# Altium schematic sheet 02_PCIE.SchDoc: =GlobalProjectName
size 594 x 420 mm; CheckedBy: A_D; Author: A_D; SheetNumber: 2; SheetTotal: 4; PageSetup: Record=PageOptions|CenterHorizontal=True|CenterVertical=True|PrintScale=0.70|XCorrection=1.00|YCorrection=1.00|PrintKind=2|BorderSize=5000000|LeftOffset=9000|BottomOffset=10100|Orientation=2|PaperLength=11176|PaperWidth=8636|Scale=100|PaperSource=259|PrintQuality=-3|MediaType=1|DitherType=10|PrintScaleMode=1|PaperKind=A3|PaperIndex=8
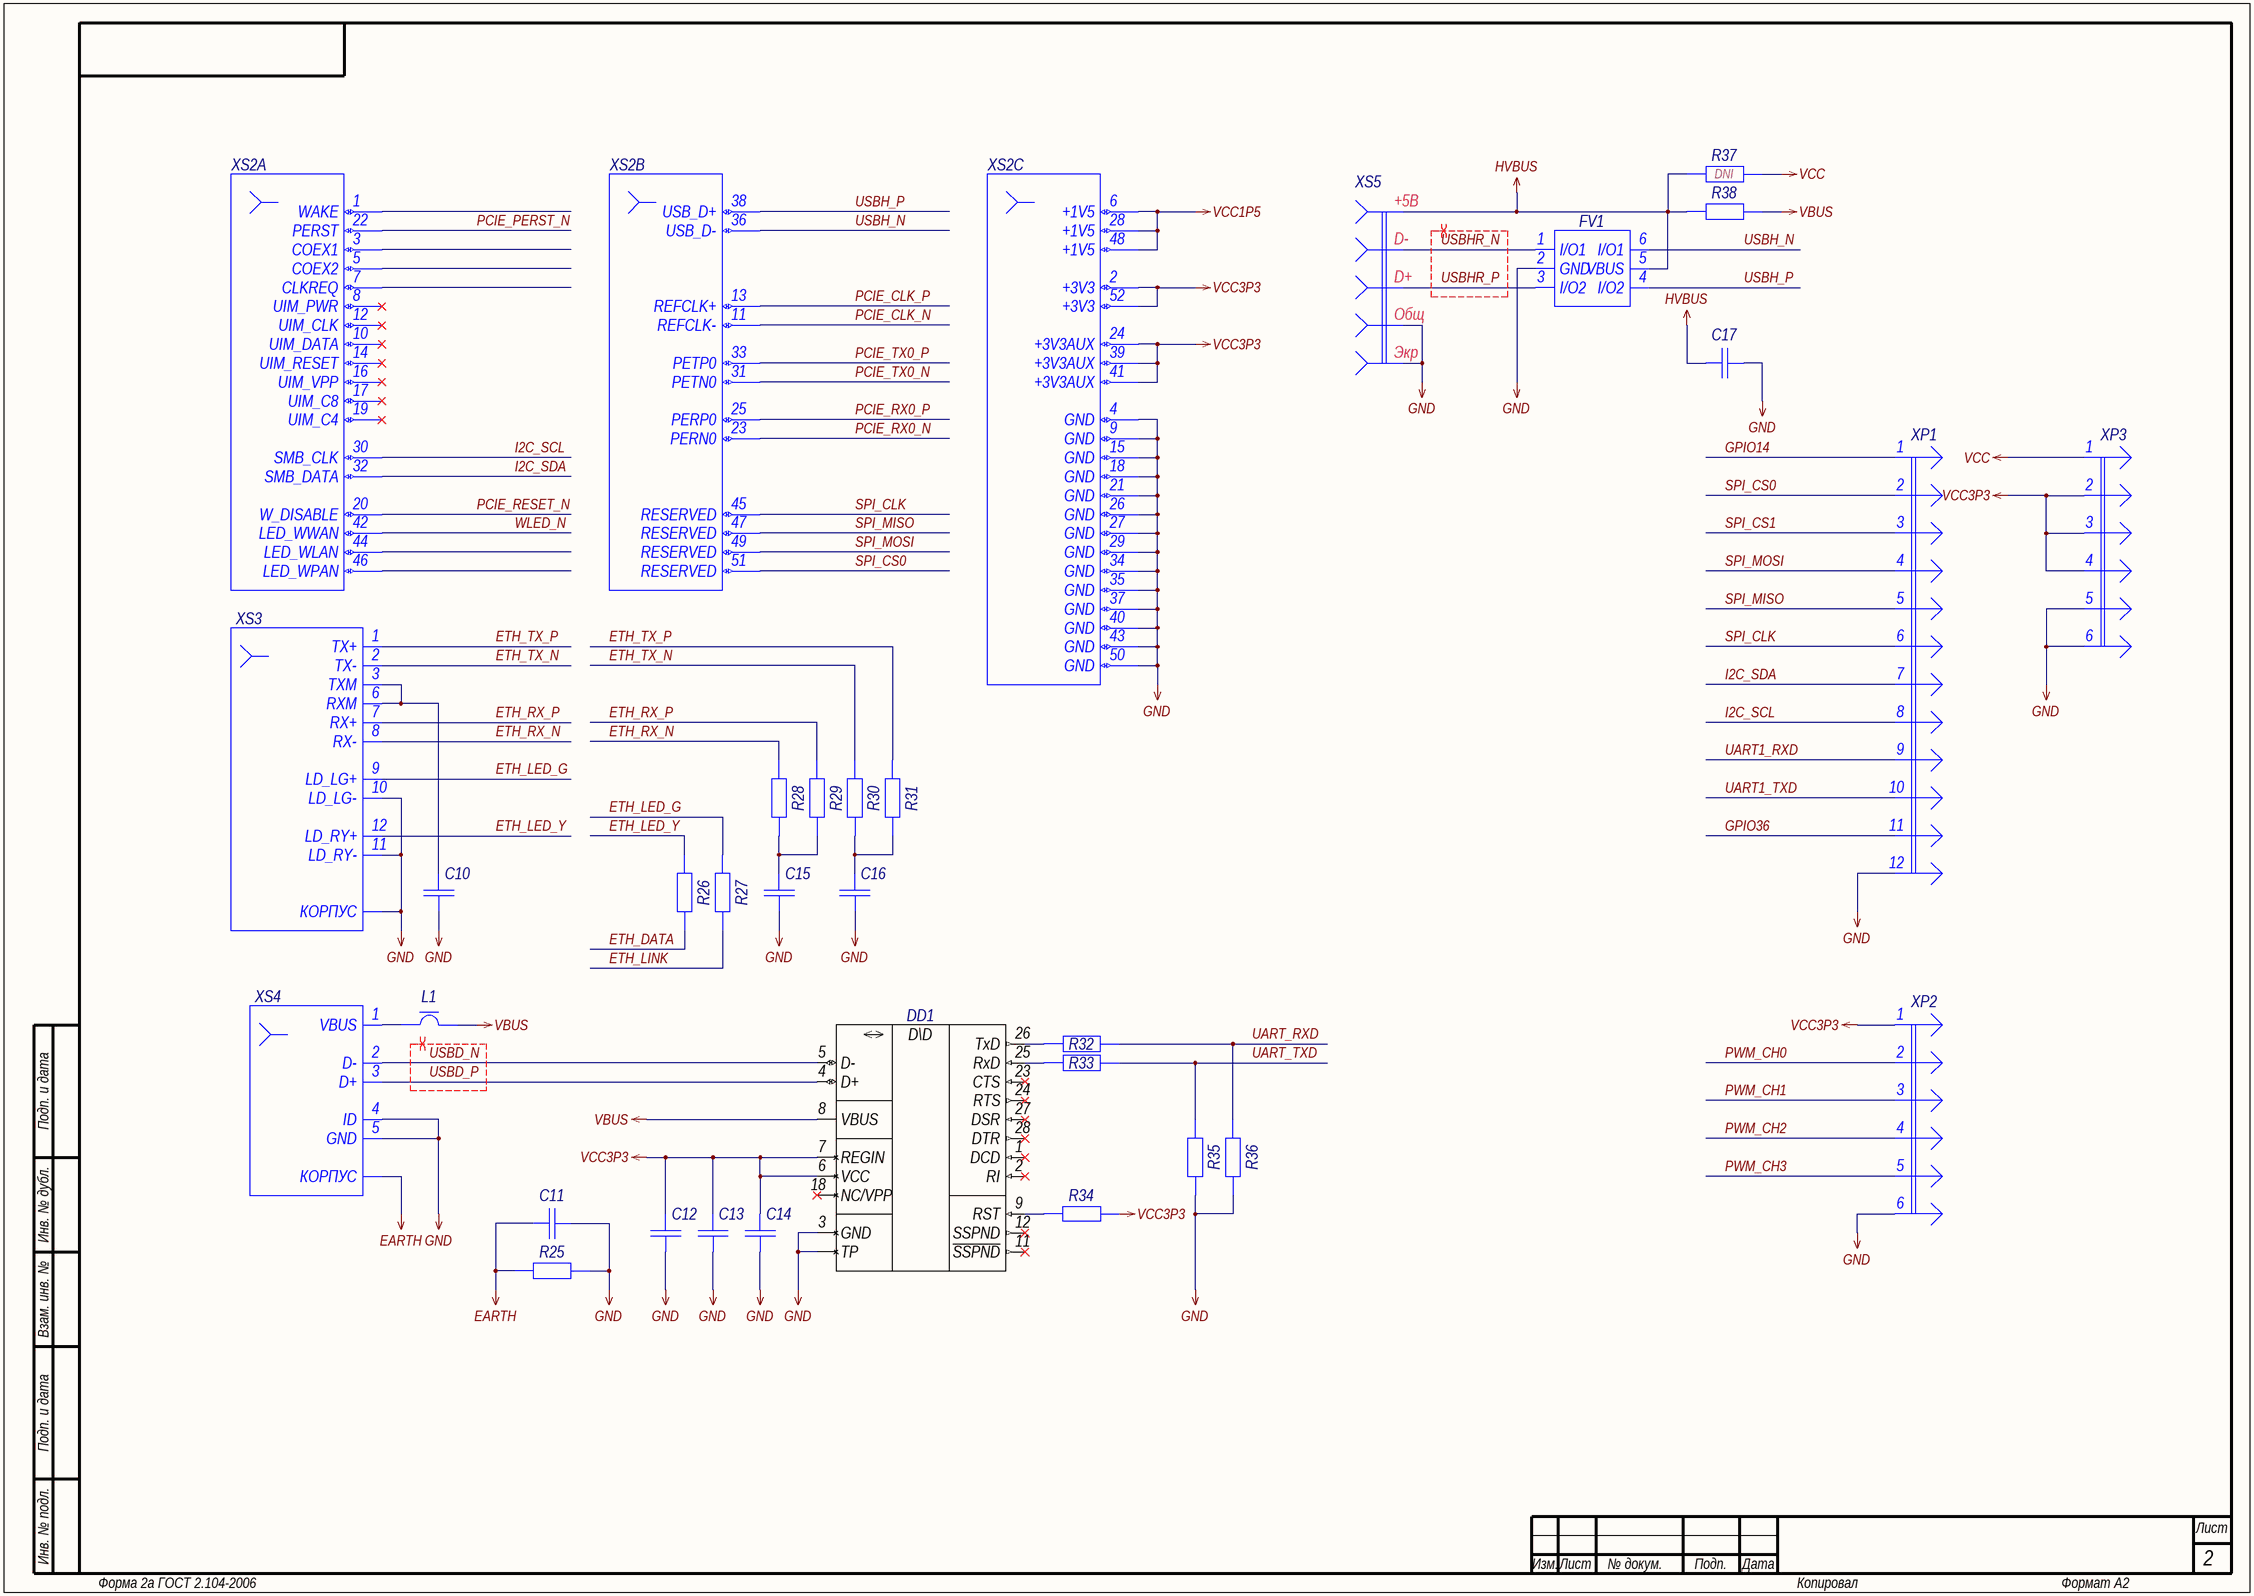
[diagram p0: 02_PCIE.SchDoc]

## Parts
C10  Capacitor  [C0603_L]  (value not drawn)
C11  Capacitor  [C0603_L]  (value not drawn)
C12  Capacitor  [C0603_L]  (value not drawn)
C13  Capacitor  [C0603_L]  (value not drawn)
C14  Capacitor  [C0603_L]  (value not drawn)
C15  Capacitor  [C0603_L]  (value not drawn)
C16  Capacitor  [C0603_L]  (value not drawn)
C17  Capacitor  [C0603_L]  (value not drawn)
DD1  CP2102_9  [QFN-28_050P500X500X100_N]  (value not drawn)
FV1  USBLC6-2SC6  [SOT-23-6_095P290X160X145_N]  (value not drawn)
L1  FerriteBead  [L0805_L]  (value not drawn)
R25  Resistor  [R0603_L]  (value not drawn)
R26  Resistor  [R0603_L]  (value not drawn)
R27  Resistor  [R0603_L]  (value not drawn)
R28  Resistor  [R0603_L]  (value not drawn)
R29  Resistor  [R0603_L]  (value not drawn)
R30  Resistor  [R0603_L]  (value not drawn)
R31  Resistor  [R0603_L]  (value not drawn)
R32  Resistor  [R0603_L]  (value not drawn)
R33  Resistor  [R0603_L]  (value not drawn)
R34  Resistor  [R0603_L]  (value not drawn)
R35  Resistor  [R0603_L]  (value not drawn)
R36  Resistor  [R0603_L]  (value not drawn)
R37  Resistor  [R0603_L]  (value not drawn)  (no BOM)
R38  Resistor  [R0603_L]  (value not drawn)
XP1  IO  [PLS-12]  (value not drawn)
XP2  POWER  [PLS-6]  (value not drawn)
XP3  POWER  [PLS-6]  (value not drawn)
XS2  Text  [2041119-2]  (value not drawn)  (parts A,B,C of 3)  (no BOM)
XS3  ETH  [SK02-111006NL]  (value not drawn)
XS4  Text  [A01SB141B1-067]  (value not drawn)
XS5  Text  [DS1095]  (value not drawn)

## Nets
EARTH: C11.2 R25.1 XS4.SHELL(КОРПУС)
GND: C10.1 C11.1 C12.1 C13.1 C14.1 C15.1 C16.1 C17.2 DD1.3(GND) DD1.TP FV1.2(GND) R25.2 R35.1 R36.1 XP1.12 XP2.6 XP3.5 XP3.6 XS2.4(GND) XS2.9(GND) XS2.15(GND) XS2.18(GND) XS2.21(GND) XS2.26(GND) XS2.27(GND) XS2.29(GND) XS2.34(GND) XS2.35(GND) XS2.37(GND) XS2.40(GND) XS2.43(GND) XS2.50(GND) XS3.10(LD_LG-) XS3.11(LD_RY-) XS3.CASE(КОРПУС) XS4.4(ID) XS4.5(GND) XS5.4 XS5.5
HVBUS: C17.1 FV1.5(VBUS) R37.1 R38.1 XS5.1
VBUS: DD1.8(VBUS) L1.2 R38.2
VCC: R37.2 XP3.1
VCC1P5: XS2.6(+1V5) XS2.28(+1V5) XS2.48(+1V5)
VCC3P3: C12.2 C13.2 C14.2 DD1.6(VCC) DD1.7(REGIN) R34.1 XP2.1 XP3.2 XP3.3 XP3.4 XS2.2(+3V3) XS2.24(+3V3AUX) XS2.39(+3V3AUX) XS2.41(+3V3AUX) XS2.52(+3V3)
ETH_DATA: R26.1
ETH_LED_G: R27.2 XS3.9(LD_LG+)
ETH_LED_Y: R26.2 XS3.12(LD_RY+)
ETH_LINK: R27.1
ETH_RX_N: R28.2 XS3.8(RX-)
ETH_RX_P: R29.2 XS3.7(RX+)
ETH_TX_N: R30.2 XS3.2(TX-)
ETH_TX_P: R31.2 XS3.1(TX+)
GPIO14: XP1.1
GPIO36: XP1.11
I2C_SCL: XP1.8 XS2.30(SMB_CLK)
I2C_SDA: XP1.7 XS2.32(SMB_DATA)
PCIE_CLK_N: XS2.11(REFCLK-)
PCIE_CLK_P: XS2.13(REFCLK+)
PCIE_PERST_N: XS2.22(PERST)
PCIE_RESET_N: XS2.20(W_DISABLE)
PCIE_RX0_N: XS2.23(PERN0)
PCIE_RX0_P: XS2.25(PERP0)
PCIE_TX0_N: XS2.31(PETN0)
PCIE_TX0_P: XS2.33(PETP0)
PWM_CH0: XP2.2
PWM_CH1: XP2.3
PWM_CH2: XP2.4
PWM_CH3: XP2.5
SPI_CLK: XP1.6 XS2.45(RESERVED)
SPI_CS0: XP1.2 XS2.51(RESERVED)
SPI_CS1: XP1.3
SPI_MISO: XP1.5 XS2.47(RESERVED)
SPI_MOSI: XP1.4 XS2.49(RESERVED)
UART1_RXD: XP1.9
UART1_TXD: XP1.10
UART_RXD: R32.2 R36.2
UART_TXD: R33.2 R35.2
USBD_N: DD1.5(D-) XS4.2(D-)
USBD_P: DD1.4(D+) XS4.3(D+)
USBH_N: FV1.6(I/O1) XS2.36(USB_D-)
USBH_P: FV1.4(I/O2) XS2.38(USB_D+)
USBHR_N: FV1.1(I/O1) XS5.2
USBHR_P: FV1.3(I/O2) XS5.3
WLED_N: XS2.42(LED_WWAN)
NetC10_2: C10.2 XS3.3(TXM) XS3.6(RXM)
NetC15_2: C15.2 R28.1 R29.1
NetC16_2: C16.2 R30.1 R31.1
NetDD1_9: DD1.9(RST) R34.2
NetDD1_25: DD1.25(RxD) R33.1
NetDD1_26: DD1.26(TxD) R32.1
NetL1_1: L1.1 XS4.1(VBUS)

Not connected (* = marked no-connect by the designer): DD1 1(DCD)* 2(RI)* 11(~{SSPND})* 12(SSPND)* 18(NC/VPP)* 23(CTS)* 24(RTS)* 27(DSR)* 28(DTR)*; XS2 1(WAKE) 3(COEX1) 5(COEX2) 7(CLKREQ) 8(UIM_PWR)* 10(UIM_DATA)* 12(UIM_CLK)* 14(UIM_RESET)* 16(UIM_VPP)* 17(UIM_C8)* 19(UIM_C4)* 44(LED_WLAN) 46(LED_WPAN)

## Layout directives
differential pair; differential pair class USB_DiffPair; rule Matched Net Lengths [Tolerance = 1mm]: USBD_N, USBD_P, USBHR_N, USBHR_P

## Notes on the sheet
- (near R37) DNI
- Подп. и дата
- Инв. № дубл.
- Взам. инв. №
- Инв. № подл.
- Изм.
- Лист
- № докум.
- Подп.
- Дата
- Форма 2а ГОСТ 2.104-2006
- Копировал
- Формат А2
- (in symbol CP2102-GM) D\D
- (in symbol DS1095-B-R) +5В; D-; D+; Общ; Экр

## Library data of the parts
C10 C11 C13-C16 = GRM188R72A104KA35D: Manufacturer: Murata; Type: Конденсатор; ID: 232; Value: 0.1uF; Voltage: 100V; Tolerance: ±10%; Dielectric Type: X7R; Application Category: 1; Working Temperature Min: -55°С; Working Temperature Max: +125°С; Published: 18.05.2010; Publisher: Andrew Danich; Part Number: GRM188R72A104KA35D; Footprint: 0603
  C11: ClassName: DirectConnect
C12 = GCM188R71E105KA64D: Manufacturer: Murata; Type: Конденсатор; ID: 134; Value: 1uF; Voltage: 25V; Tolerance: ±10%; Dielectric Type: X7R; Application Category: 1; Working Temperature Min: -55°С; Working Temperature Max: +85°С; Published: 18.05.2010; Publisher: Andrew Danich; Part Number: GCM188R71E105KA64D; Footprint: 0603
C17 = GRM188R61A106KE69D: Manufacturer: Murata; Type: Конденсатор; ID: 173; Value: 10uF; Voltage: 10V; Tolerance: ±10%; Dielectric Type: X5R; Application Category: 1; Working Temperature Min: -55°С; Working Temperature Max: +85°С; Published: 18.05.2010; Publisher: Andrew Danich; Part Number: GRM188R61A106KE69D; Footprint: 0603
DD1 = CP2102-GM: Single Chip USB to UART Bridge; Manufacturer: Silicon Labs; ID: 4; Supply Operation: +3.3V; Supply Current: 13.7mA; USB Type Support: USB 2.0; USB Speed Support: 12 Mb/s; OTG Support: No; Channels: 1; Working Temperature Min: -40°C; Working Temperature Max: +85°C; Published: 03.08.2015; Publisher: Andrew Danich; Type: Микросхема; Part Number: CP2102-GM; Value: CP2102-GM; Input Interface: UART; Application Category: 1; Functional Analog: -
FV1 = USBLC6-2SC6: Manufacturer: STMicroelectronics; ID: 11; Breakdown Voltage: 6V; Reverse Stand Off Voltage: 17V; Forward Voltage: 0.95V; Peak Forward Current: 5A; Junction Capacitance: 2.5pF; Directional: Bidirectional; Application Category: 1; Working Temperature Min: -40°С; Working Temperature Max: +125°С; Published: 21.02.2017; Publisher: Andrew Danich; Type: Супрессор; Part Number: USBLC6-2SC6; Value: USBLC6-2SC6; Functional Analog: -
L1 = BLM21PG331SN1: Manufacturer: Murata; Type: Дроссель; ID: 2; Rated Current: 1.5A; Impedance at 100Mhz: 330ohm; Tolerance: ±25%; DC Resistance: 0.07ohm; Inductor Type: EMIFIL; Application Category: 1; Working Temperature Min: -55°С; Working Temperature Max: +125°С; Published: 14.11.2014; Publisher: Andrew Danich; Part Number: BLM21PG331SN1; Value: BLM21PG331SN1; Footprint: 0805; ClassName: DirectConnect
R25 = RC0603JR-07100KL: Manufacturer: Yageo; ID: 11; Value: 100k; Limit Voltage: 50V; Tolerance: ±5%; Temperature Coefficient: 100ppm; Total Power Dissipation: 0.1W; Series Type: Thick-Film; Application Category: 1; Working Temperature Min: -55°С; Working Temperature Max: +155°С; Functional Analog: CR0603-JW-104E; Published: 24.03.2010; Publisher: Andrew Danich; Type: Резистор; Part Number: RC0603JR-07100KL; Footprint: 0603; ClassName: DirectConnect
R26 R27 = RC0603JR-07330RL: Manufacturer: Yageo; ID: 313; Value: 330; Limit Voltage: 50V; Tolerance: ±5%; Temperature Coefficient: 100ppm; Total Power Dissipation: 0.1W; Series Type: Thick-Film; Application Category: 1; Working Temperature Min: -55°С; Working Temperature Max: +155°С; Functional Analog: CR0603-JW-331E; Published: 24.03.2010; Publisher: Andrew Danich; Type: Резистор; Part Number: RC0603JR-07330RL; Footprint: 0603
R28-R31 = RC0603FR-0749R9L: Manufacturer: Yageo; ID: 249; Value: 49.9; Limit Voltage: 50V; Tolerance: ±1%; Temperature Coefficient: 100ppm; Total Power Dissipation: 0.1W; Series Type: Thick-Film; Application Category: 1; Working Temperature Min: -55°С; Working Temperature Max: +155°С; Functional Analog: CR0603-FX-49R9E; Published: 24.03.2010; Publisher: Andrew Danich; Type: Резистор; Part Number: RC0603FR-0749R9L; Footprint: 0603
R32 R33 = RC0603JR-071KL: Manufacturer: Yageo; ID: 19; Value: 1k; Limit Voltage: 50V; Tolerance: ±5%; Temperature Coefficient: 100ppm; Total Power Dissipation: 0.1W; Series Type: Thick-Film; Application Category: 1; Working Temperature Min: -55°С; Working Temperature Max: +155°С; Functional Analog: CR0603-JW-102E; Published: 24.03.2010; Publisher: Andrew Danich; Type: Резистор; Part Number: RC0603JR-071KL; Footprint: 0603
R34 = RC0603JR-074K7L: Manufacturer: Yageo; ID: 56; Value: 4.7k; Limit Voltage: 50V; Tolerance: ±5%; Temperature Coefficient: 100ppm; Total Power Dissipation: 0.1W; Series Type: Thick-Film; Application Category: 1; Working Temperature Min: -55°С; Working Temperature Max: +155°С; Published: 24.03.2010; Publisher: Andrew Danich; Type: Резистор; Part Number: RC0603JR-074K7L; Footprint: 0603
R35 R36 = RC0603JR-073KL: Manufacturer: Yageo; ID: 52; Value: 3k; Limit Voltage: 50V; Tolerance: ±5%; Temperature Coefficient: 100ppm; Total Power Dissipation: 0.1W; Series Type: Thick-Film; Application Category: 1; Working Temperature Min: -55°С; Working Temperature Max: +155°С; Published: 24.03.2010; Publisher: Andrew Danich; Type: Резистор; Part Number: RC0603JR-073KL; Footprint: 0603
R37 R38 = RC0603JR-070R: Manufacturer: Yageo; ID: 5; Value: 0; Limit Voltage: 50V; Tolerance: ±5%; Temperature Coefficient: 100ppm; Total Power Dissipation: 0.1W; Series Type: Thick-Film; Application Category: 1; Working Temperature Min: -55°С; Working Temperature Max: +155°С; Functional Analog: RC0603FR-070RL, CR0603-J/-000E; Published: 24.03.2010; Publisher: Andrew Danich; Type: Резистор; Part Number: RC0603JR-070R; Footprint: 0603
XP1 = PLS-12: Value: PLS-12; ID: 10; Limit Voltage: 250V; Limit Current: 3A; Connector Type: Male; Resistance: 15momh; Surface Finish: Gold; Pitch: 2.54mm; Application Category: 1; Published: 07.03.2013; Publisher: Andrew Danich; Type: Вилка; Part Number: PLS-12; Pins: 12
XP2 XP3 = PLS-6: Value: PLS-6; ID: 5; Limit Voltage: 250V; Limit Current: 3A; Connector Type: Male; Resistance: 15momh; Surface Finish: Gold; Pitch: 2.54mm; Application Category: 1; Published: 07.03.2013; Publisher: Andrew Danich; Type: Вилка; Part Number: PLS-6; Pins: 6
XS2 = 2041119-2: Manufacturer: TE Connectivity; ID: 2; Connector Type: Card Edge; Surface Finish: Gold; Pitch: 0.8mm; Application Category: 1; Published: 06.03.2019; Publisher: Andrew Danich; Type: Розетка; Part Number: 2041119-2; Value: 2041119-2; Pins: 52
XS3 = SK02-111006NL: Manufacturer: Sanken Electric Co., Ltd; ID: 18; Limit Voltage: 125V; Limit Current: 1.5A; Connector Type: Female; Interface: Ethernet/Int.Trans.; Max Data Rate: 10/100Mbs; Application Category: 1; Working Temperature Min: -40°С; Working Temperature Max: +70°С; Value: SK02-111006NL; Published: 08.09.2014; Publisher: Andrew Danich; Type: Розетка; Part Number: SK02-111006NL; Pins: 12; Mount Type: Through hole; Functional Analog: -
XS4 = A01SB141B1-067: Manufacturer: Jing Extension of the Electronic Co; ID: 37; Limit Voltage: 30V; Limit Current: 1A; Connector Type: Female; Interface: USB 2.0; Max Data Rate: 480 mbps; Application Category: 1; Published: 17.09.2018; Publisher: Andrew Danich; Type: Розетка; Part Number: A01SB141B1-067; Value: A01SB141B1-067; Pins: 5; Mount Type: Surface; ClassName: DirectConnect
XS5 = DS1095-B-R: Manufacturer: Connfly Electronic Co., Ltd; ID: 19; Limit Voltage: 30V; Limit Current: 1.5A; Connector Type: Female; Interface: USB 2.0; Max Data Rate: 480 mbps; Application Category: 1; Value: DS1095-B-R; Published: 07.03.2013; Publisher: Andrew Danich; Type: Розетка; Part Number: DS1095-B-R; Pins: 6; Mount Type: Through hole